# Altium schematic sheet Sheet1.SchDoc
size A3; SheetNumber: 1; SheetTotal: 1
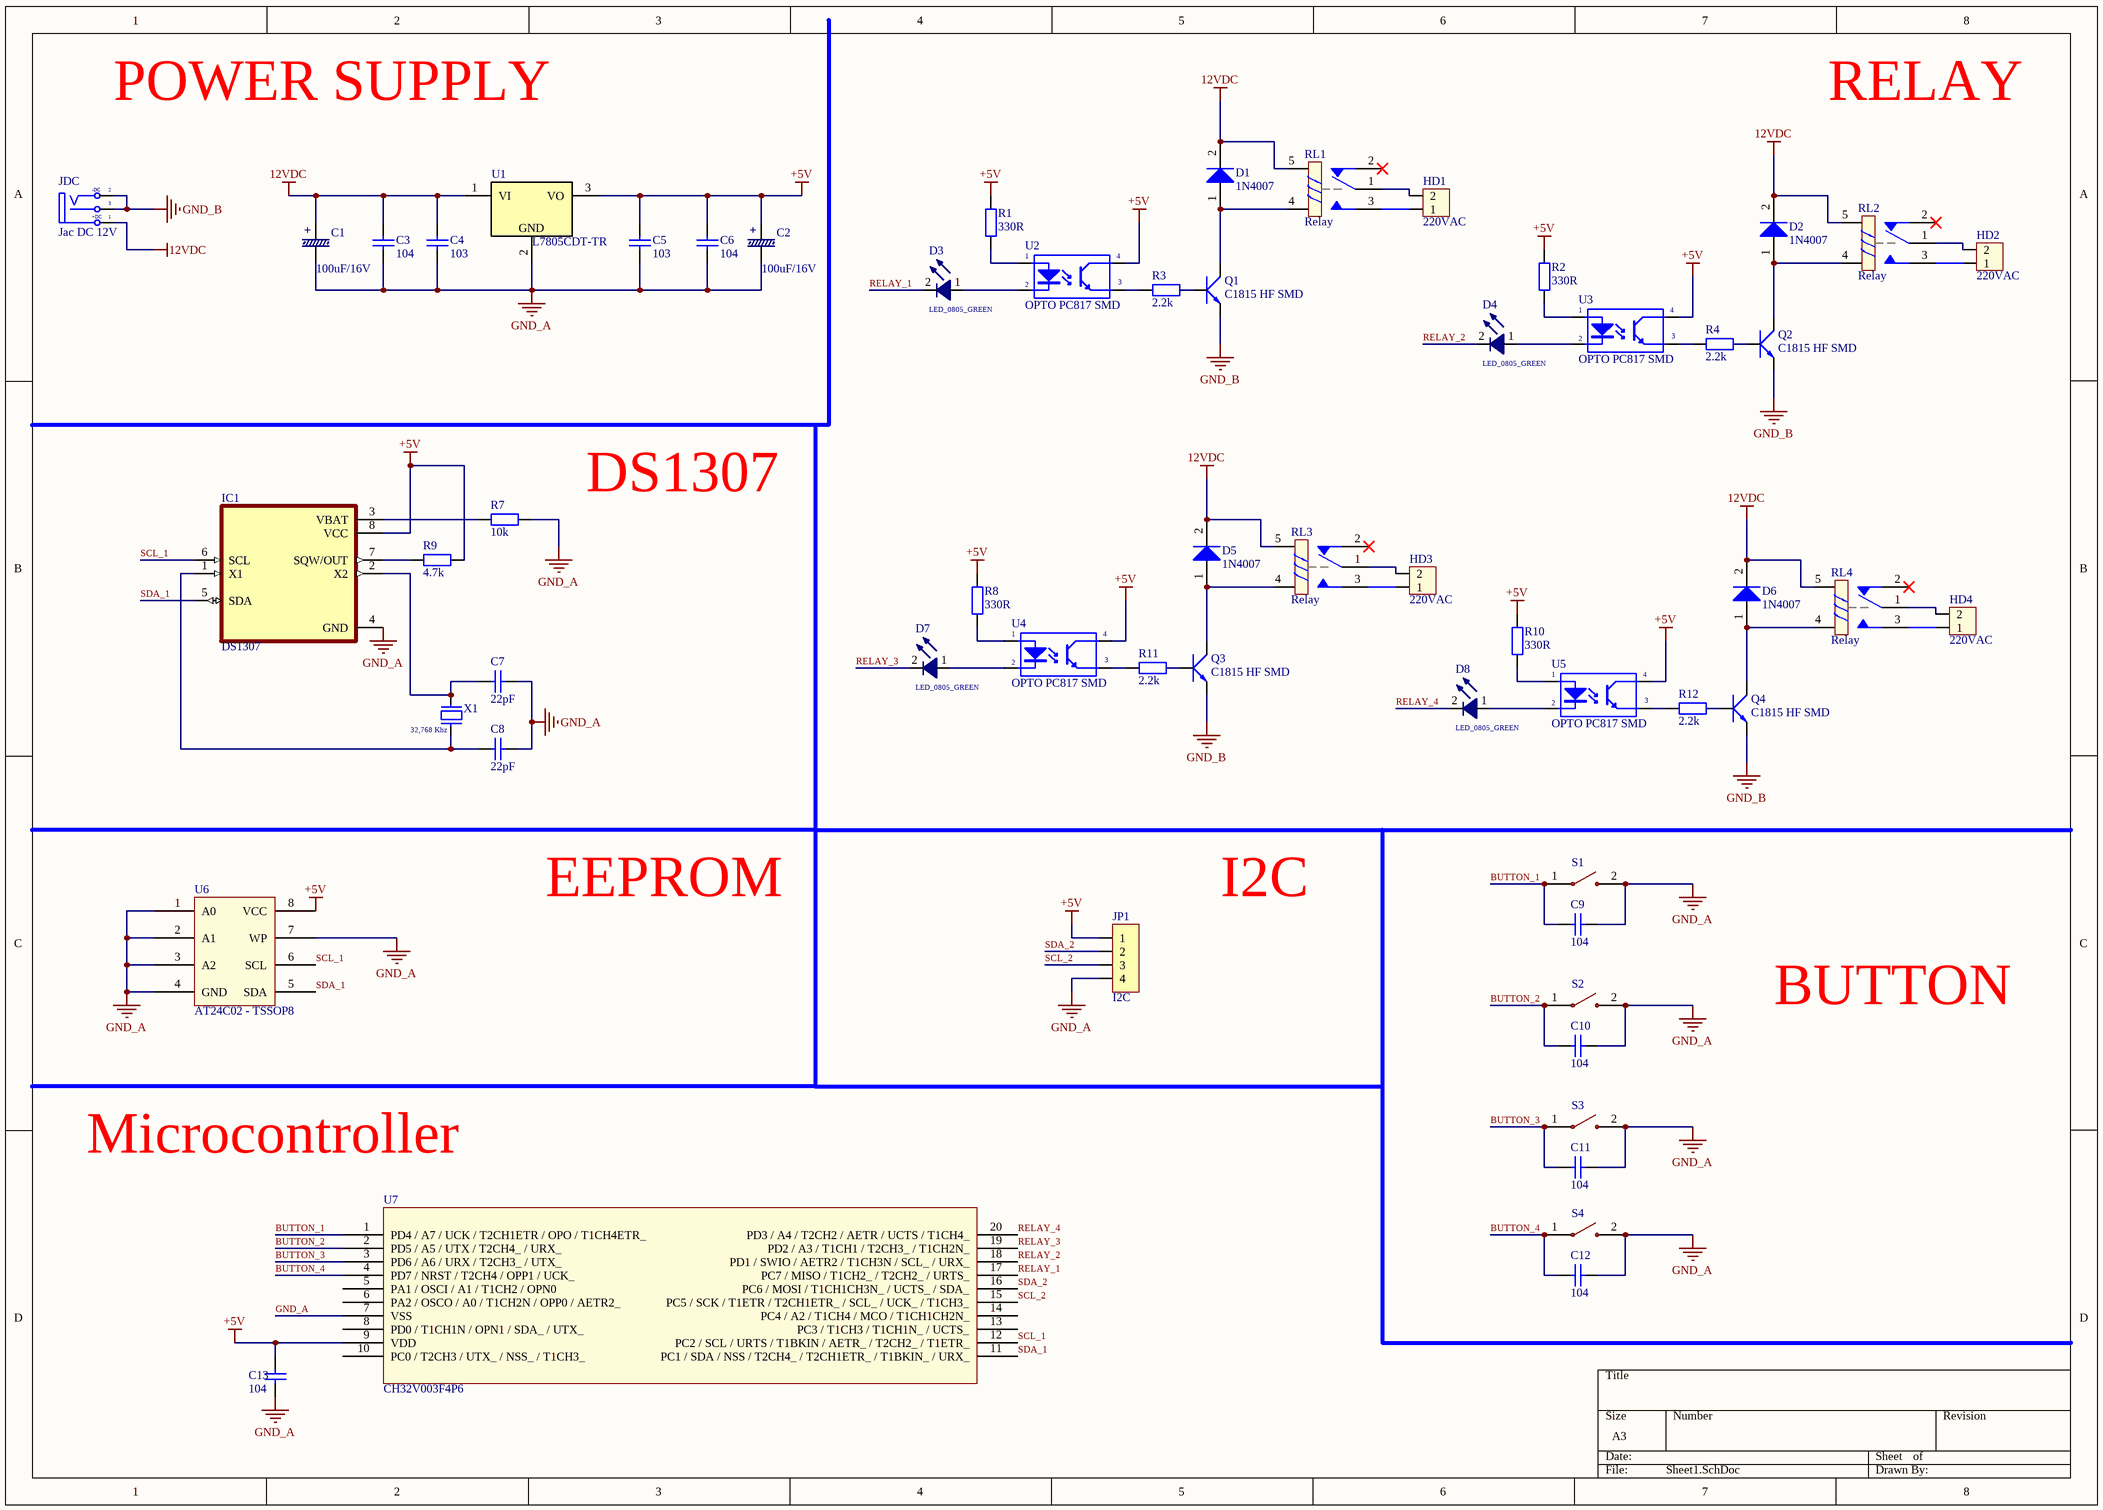
[diagram p0: Sheet1.SchDoc]

## Parts
C1  100uF/16V  [ALUMINUM_7mm]
C2  100uF/16V  [ALUMINUM_7mm]
C3  104  [tu 0603]
C4  103  [tu 0603]
C5  103  [tu 0603]
C6  104  [tu 0603]
C7  22pF  [tu 1206]
C8  22pF  [tu 1206]
C9  104  [tu 0603]
C10  104  [tu 0603]
C11  104  [tu 0603]
C12  104  [tu 0603]
C13  104  [tu 0603]
D1  1N4007  [DIODE SMA]
D2  1N4007  [DIODE SMA]
D3  LED_0805_GREEN  [LED_0805_GREEN]
D4  LED_0805_GREEN  [LED_0805_GREEN]
D5  1N4007  [DIODE SMA]
D6  1N4007  [DIODE SMA]
D7  LED_0805_GREEN  [LED_0805_GREEN]
D8  LED_0805_GREEN  [LED_0805_GREEN]
HD1  220VAC  [HED2]
HD2  220VAC  [HED2]
HD3  220VAC  [HED2]
HD4  220VAC  [HED2]
IC1  DS1307  [DS1307]
JDC  Jac DC 12V  [DC-IN]
JP1  I2C  [JP 1x4 DT]
Q1  C1815 HF SMD  [SOT23]
Q2  C1815 HF SMD  [SOT23]
Q3  C1815 HF SMD  [SOT23]
Q4  C1815 HF SMD  [SOT23]
R1  330R  [tro smd 0603]
R2  330R  [tro smd 0603]
R3  2.2k  [tro smd 0603]
R4  2.2k  [tro smd 0603]
R7  10k  [tro smd 0603]
R8  330R  [tro smd 0603]
R9  4.7k  [tro smd 0603]
R10  330R  [tro smd 0603]
R11  2.2k  [tro smd 0603]
R12  2.2k  [tro smd 0603]
RL1  Relay  [Relay 5 Chan SRD]
RL2  Relay  [Relay 5 Chan SRD]
RL3  Relay  [Relay 5 Chan SRD]
RL4  Relay  [Relay 5 Chan SRD]
S1  PUSH_BUTTON_SMD_3X4X2  [PUSH_BUTTON_SMD_3X4X2]  (value not drawn)
S2  PUSH_BUTTON_SMD_3X4X2  [PUSH_BUTTON_SMD_3X4X2]  (value not drawn)
S3  PUSH_BUTTON_SMD_3X4X2  [PUSH_BUTTON_SMD_3X4X2]  (value not drawn)
S4  PUSH_BUTTON_SMD_3X4X2  [PUSH_BUTTON_SMD_3X4X2]  (value not drawn)
U1  L7805CDT-TR  [DPAK_118_446_112X59_SMD]
U2  OPTO PC817 SMD  [SOP4]
U3  OPTO PC817 SMD  [SOP4]
U4  OPTO PC817 SMD  [SOP4]
U5  OPTO PC817 SMD  [SOP4]
U6  AT24C02 - TSSOP8  [AT24C02]
U7  CH32V003F4P6  [CH32V003F4P6]
X1  32,768 Khz  [XT32kn]

## Nets
12VDC: C1.1 C3.1 C4.1 D1.2(K) D2.2(K) D5.2(K) D6.2(K) JDC.1(T) RL1.5 RL2.5 RL3.5 RL4.5 U1.1(VI)
+5V: C2.1 C5.1 C6.1 C13.1 IC1.8(VCC) JP1.1 R1.2 R2.2 R8.2 R9.1 R10.2 U1.3(VO) U2.4(C) U3.4(C) U4.4(C) U5.4(C) U6.8(VCC) U7.9(VDD)
GND_A: C1.2 C2.2 C3.2 C4.2 C5.2 C6.2 C7.2 C8.2 C9.1 C10.1 C11.1 C12.1 C13.2 IC1.4(GND) JP1.4 R7.2 S1.2 S2.2 S3.2 S4.2 U1.2 U6.1(A0) U6.2(A1) U6.3(A2) U6.4(GND) U6.7(WP) U7.7(VSS)
GND_B: JDC.2(TN) JDC.3(S) Q1.2(E) Q2.2(E) Q3.2(E) Q4.2(E)
BUTTON_1: C9.2 S1.1 U7.1(PD4_/_A7_/_UCK_/_T2CH1ETR_/_OPO_/_T1CH4ETR_)
BUTTON_2: C10.2 S2.1 U7.2(PD5_/_A5_/_UTX_/_T2CH4__/_URX_)
BUTTON_3: C11.2 S3.1 U7.3(PD6_/_A6_/_URX_/_T2CH3__/_UTX_)
BUTTON_4: C12.2 S4.1 U7.4(PD7_/_NRST_/_T2CH4_/_OPP1_/_UCK_)
RELAY_1: D3.2 U7.17(PC7_/_MISO_/_T1CH2__/_T2CH2__/_URTS_)
RELAY_2: D4.2 U7.18(PD1_/_SWIO_/_AETR2_/_T1CH3N_/_SCL__/_URX_)
RELAY_3: D7.2 U7.19(PD2_/_A3_/_T1CH1_/_T2CH3__/_T1CH2N_)
RELAY_4: D8.2 U7.20(PD3_/_A4_/_T2CH2_/_AETR_/_UCTS_/_T1CH4_)
SCL_1: IC1.6(SCL) U6.6(SCL) U7.12(PC2_/_SCL_/_URTS_/_T1BKIN_/_AETR__/_T2CH2__/_T1ETR_)
SCL_2: JP1.3 U7.15(PC5_/_SCK_/_T1ETR_/_T2CH1ETR__/_SCL__/_UCK__/_T1CH3_)
SDA_1: IC1.5(SDA) U6.5(SDA) U7.11(PC1_/_SDA_/_NSS_/_T2CH4__/_T2CH1ETR__/_T1BKIN__/_URX_)
SDA_2: JP1.2 U7.16(PC6_/_MOSI_/_T1CH1CH3N__/_UCTS__/_SDA_)
NetC7_1: C7.1 IC1.2(X2) X1.2
NetC8_1: C8.1 IC1.1(X1) X1.1
NetD1_1: D1.1(A) Q1.3(C) RL1.4
NetD2_1: D2.1(A) Q2.3(C) RL2.4
NetD3_1: D3.1 U2.2(K)
NetD4_1: D4.1 U3.2(K)
NetD5_1: D5.1(A) Q3.3(C) RL3.4
NetD6_1: D6.1(A) Q4.3(C) RL4.4
NetD7_1: D7.1 U4.2(K)
NetD8_1: D8.1 U5.2(K)
NetHD1_1: HD1.1 RL1.3
NetHD1_2: HD1.2 RL1.1
NetHD2_1: HD2.1 RL2.3
NetHD2_2: HD2.2 RL2.1
NetHD3_1: HD3.1 RL3.3
NetHD3_2: HD3.2 RL3.1
NetHD4_1: HD4.1 RL4.3
NetHD4_2: HD4.2 RL4.1
NetIC1_3: IC1.3(VBAT) R7.1
NetIC1_7: IC1.7(SQW/OUT) R9.2
NetQ1_1: Q1.1(B) R3.2
NetQ2_1: Q2.1(B) R4.2
NetQ3_1: Q3.1(B) R11.2
NetQ4_1: Q4.1(B) R12.2
NetR1_1: R1.1 U2.1(A)
NetR2_1: R2.1 U3.1(A)
NetR3_1: R3.1 U2.3(E)
NetR4_1: R4.1 U3.3(E)
NetR8_1: R8.1 U4.1(A)
NetR10_1: R10.1 U5.1(A)
NetR11_1: R11.1 U4.3(E)
NetR12_1: R12.1 U5.3(E)

Not connected (* = marked no-connect by the designer): RL1 2*; RL2 2*; RL3 2*; RL4 2*; U7 5(PA1_/_OSCI_/_A1_/_T1CH2_/_OPN0) 6(PA2_/_OSCO_/_A0_/_T1CH2N_/_OPP0_/_AETR2_) 8(PD0_/_T1CH1N_/_OPN1_/_SDA__/_UTX_) 10(PC0_/_T2CH3_/_UTX__/_NSS__/_T1CH3_) 13(PC3_/_T1CH3_/_T1CH1N__/_UCTS_) 14(PC4_/_A2_/_T1CH4_/_MCO_/_T1CH1CH2N_)

## Notes on the sheet
- POWER SUPPLY
- RELAY
- DS1307
- EEPROM
- I2C
- BUTTON
- Microcontroller
- (in symbol 100uF/16V) +
- (in symbol DCIN) -DC; +DC
- (in symbol REG_35V_5V-1.5A-7.5W-DPAK) GND

## Library data of the parts
C1 C2 = 100uF/16V: Aluminum Capacitor 100uF/16V 7mm
C3-C6 C9-C13 = Tu 0603 104 50V 10%: Dán; Don_Vi: Con; So_Chan: 2; Ten_Linh_Kien: Tụ 0603 104-100nF 10% 50V; Ma_Hang: MH004568; Chung_Loai: Dán; Kieu_Chan: *
C7 C8 = Tu 1206 22pF 50V 10%: Dán; Ma_Hang: MH004547; Don_Vi: Con; So_Chan: 2; Ten_Linh_Kien: Tụ 1206 22P 10% 50V; Chung_Loai: Dán; Kieu_Chan: *
D1 D2 D5 D6 = Diode M7 ( 4007 ): Dán; Don_Vi: Con; Ten_Linh_Kien: Diode M7 1N4007 SMD 1A 1000V; Ma_Hang: MH000944; Chung_Loai: Dán; Ghi_Chu: *
D3 D4 D7 D8 = LED_0805_GREEN: LED 0805 Green.; JLCPCB PN: C2297
HD1-HD4 = Hed2: Header 2 (Green); Value: Header 2
JDC = DCIN: Jac DC input; Value: Jac DC
JP1 = JP 1x4 2.54 Duc Thang: Cắm; Ten_Linh_Kien: Jump Đơn Đực 2.54MM 1x40P Thẳng 11MM; Don_Vi: Con; Ma_Hang: MH000903; Ghi_Chu: *; Kieu_Chan: *; Chung_Loai: Cắm
Q1-Q4 = C1815 HF SMD: NPN transistor; Value: C9014
R1 R2 R8 R10 = Tro 0603 5% 330R: Dán; Don_Vi: Con; Ma_Hang: MH006910; So_Chan: 2; Ten_Linh_Kien: Trở 0603 5% 330R; Chung_Loai: Dán; Kieu_Chan: *
R3 R4 R11 R12 = Tro 0603 5% 2.2k: Dán; Don_Vi: Con; So_Chan: 2; Ten_Linh_Kien: Trở 0603 5% 2.2k; Ma_Hang: MH006321; Chung_Loai: Dán; Kieu_Chan: *
R7 = Tro 0603 1% 10k: Dán; Don_Vi: Con; So_Chan: 2; Ten_Linh_Kien: Trở 0603 1% 10k; Ma_Hang: MH006333; Chung_Loai: Dán; Kieu_Chan: *
R9 = Tro 0603 5% 4.7k: Dán; Don_Vi: Con; So_Chan: 2; Ten_Linh_Kien: Trở 0603 5% 4.7k; Ma_Hang: MH006327; Chung_Loai: Dán; Kieu_Chan: *
RL1-RL4 = Relay 5 Chan SRD: Relay 5 Chan; Ma_Hang: MH009374; Ten: Relay 5V10A SRD-05VDC-SL-C Chính Hãng
S1-S4 = PUSH_BUTTON_SMD_3X4X2: Push Button Tactile Switch SMD 2 Pins 3x4x2mm.; JLCPCB PN: C231644
U1 = REG_35V_5V-1.5A-7.5W-DPAK: Linear Voltage Regulator IC 1 Output 1.5A DPAK; Manufacturer: Diodes; Alternate Part Number-1: CJ7805 3%; Manufacturer Part Number: L7805CDT-TR; Case/Package: DPAK; Supplier-1: SP ROAD; Supplier Part Number-1: L7805CDT-TR
U2-U5 = OPTO PC817 SMD: Single Opto; Value: PC817
U6 = AT24C02
X1 = XT32k: Crystal 32,768kHz for timer real; Value: 32,768khz